# EAGLE schematic Parallel CS V5 repeated (EAGLE 7.2.0)

## Sheet 1 of 2: Input Layer
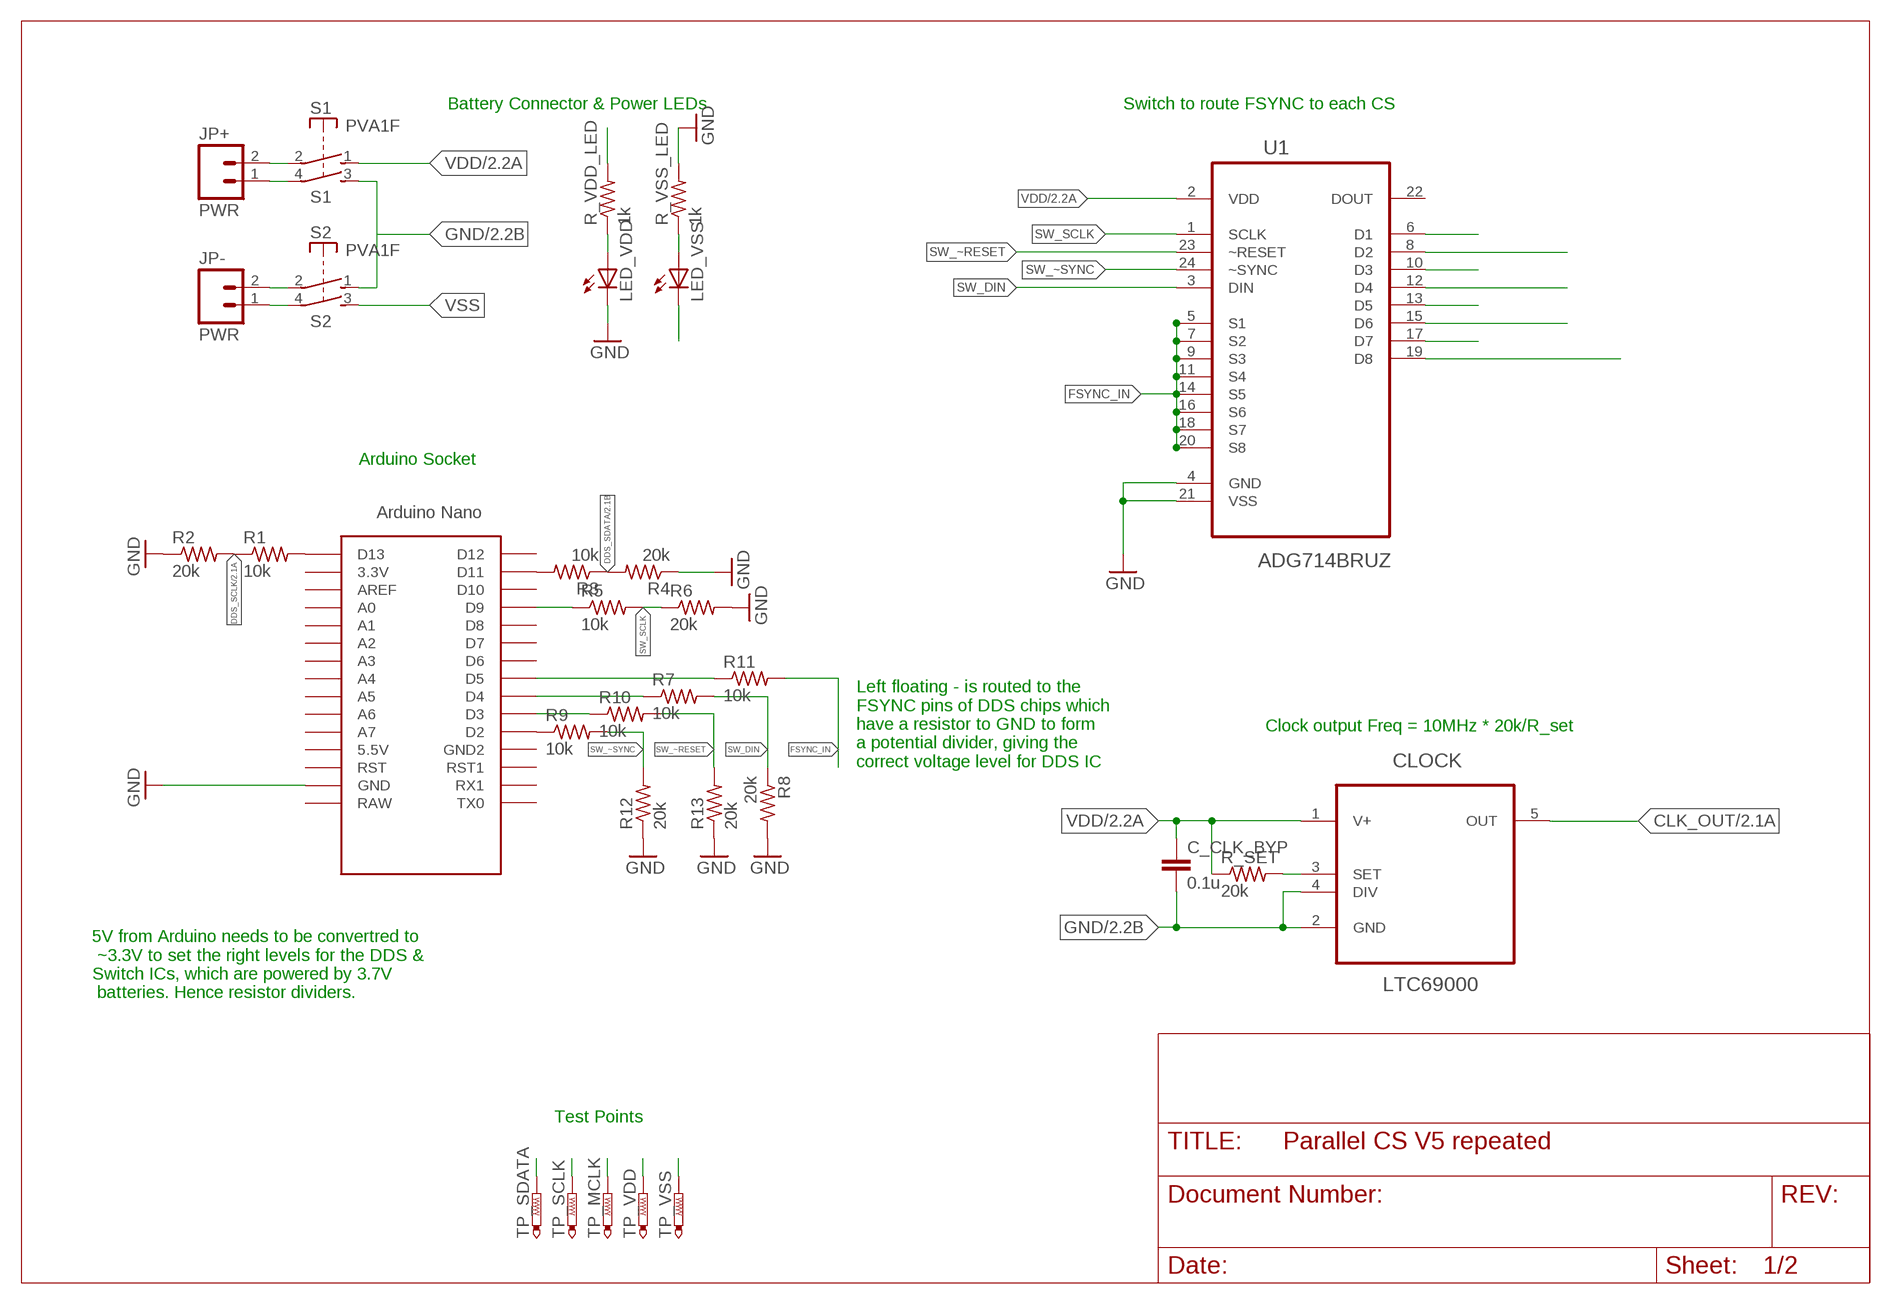
[diagram p0: schematic, sheet 1]

### Parts
C_CLK_BYP  0.1u  C-EUC0805  [C0805]
CLOCK  LTC69000  [SOT23-5L]
JP+  PWR  M02-JST-2MM-SMT  [JST-2-SMD]
JP-  PWR  M02-JST-2MM-SMT  [JST-2-SMD]
LED_VDD  LEDSML0805  [SML0805]
LED_VSS  LEDSML0805  [SML0805]
R1  10k  R-US_R0805  [R0805]
R2  20k  R-US_R0805  [R0805]
R3  10k  R-US_R0805  [R0805]
R4  20k  R-US_R0805  [R0805]
R5  10k  R-US_R0805  [R0805]
R6  20k  R-US_R0805  [R0805]
R7  10k  R-US_R0805  [R0805]
R8  20k  R-US_R0805  [R0805]
R9  10k  R-US_R0805  [R0805]
R10  10k  R-US_R0805  [R0805]
R11  10k  R-US_R0805  [R0805]
R12  20k  R-US_R0805  [R0805]
R13  20k  R-US_R0805  [R0805]
R_SET  20k  R-US_R0805  [R0805]
R_VDD_LED  1k  R-US_M0805  [M0805]
R_VSS_LED  1k  R-US_M0805  [M0805]
S1  PVA1F  [PVA1F]
S2  PVA1F  [PVA1F]
TP_MCLK  PTR1PAD1-13  [P1-13]
TP_SCLK  PTR1PAD1-13  [P1-13]
TP_SDATA  PTR1PAD1-13  [P1-13]
TP_VDD  PTR1PAD1-13  [P1-13]
TP_VSS  PTR1PAD1-13  [P1-13]
U1  ADG714BRUZ  [SOP65P640X120-24N]
U$1  NANO  [NANO]

### Nets
CLK_OUT: CLOCK.5(OUT) TP_MCLK.TP ; also sheet 2
DDS_SCLK: R1.1 R2.2 TP_SCLK.TP ; also sheet 2
DDS_SCLK_5V: R1.2 U$1.D13
DDS_SDATA: R3.1 R4.2 TP_SDATA.TP ; also sheet 2
FSYNC_CS1: U1.6(D1)
FSYNC_CS2: U1.8(D2)
FSYNC_CS3: U1.10(D3)
FSYNC_CS4: U1.12(D4)
FSYNC_CS5: U1.13(D5)
FSYNC_CS6: U1.15(D6)
FSYNC_CS7: U1.17(D7)
FSYNC_CS8: U1.19(D8)
FSYNC_IN: R11.2 U1.5(S1) U1.7(S2) U1.9(S3) U1.11(S4) U1.14(S5) U1.16(S6) U1.18(S7) U1.20(S8)
FSYNC_IN_5V: R11.1 U$1.D5
GND: C_CLK_BYP.2 CLOCK.2(GND) CLOCK.4(DIV) LED_VDD.C R2.1 R4.1 R6.2 R8.2 R12.1 R13.1 R_VSS_LED.2 S1.3(2:S) S2.1(1:S) U1.4(GND) U1.21(VSS) U$1.GND ; also sheet 2
N$2: CLOCK.3(SET) R_SET.2
N$15: JP+.2 S1.2(1:P)
N$16: JP+.1 S1.4(2:P)
N$18: JP-.2 S2.2(1:P)
N$19: JP-.1 S2.4(2:P)
N$21: LED_VDD.A R_VDD_LED.1
N$22: LED_VSS.A R_VSS_LED.1
N$23: R3.2 U$1.D11
SW_DIN: R7.2 R8.1 U1.3(DIN)
SW_DIN_5V: R7.1 U$1.D4
SW_SCLK: R5.2 R6.1 U1.1(SCLK)
SW_SCLK_5V: R5.1 U$1.D9
SW_~RESET: R10.2 R13.2 U1.23(~RESET)
SW_~RESET_5V: R10.1 U$1.D3
SW_~SYNC: R9.2 R12.2 U1.24(~SYNC)
SW_~SYNC_5V: R9.1 U$1.D2
VDD: C_CLK_BYP.1 CLOCK.1(V+) R_SET.1 R_VDD_LED.2 S1.1(1:S) TP_VDD.TP U1.2(VDD) ; also sheet 2
VSS: LED_VSS.C S2.3(2:S) TP_VSS.TP ; also sheet 2
Unconnected: U1.22(DOUT) U$1.3.3V U$1.5V(5.5V) U$1.A0 U$1.A1 U$1.A2 U$1.A3 U$1.A4 U$1.A5 U$1.A6 U$1.A7 U$1.AREF U$1.D6 U$1.D7 U$1.D8 U$1.D10 U$1.D12 U$1.GND1(GND2) U$1.ICSP1 U$1.ICSP2 U$1.ICSP3 U$1.ICSP4 U$1.ICSP5 U$1.ICSP6 U$1.RAW U$1.RST U$1.RST1 U$1.RX1 U$1.TX0

### Notes on the sheet
- Battery Connector & Power LEDs | Switch to route FSYNC to each CS
- Arduino Socket
- Clock output Freq = 10MHz * 20k/R_set
- Left floating - is routed to the
  FSYNC pins of DDS chips which
  have a resistor to GND to form
  a potential divider, giving the 
  correct voltage level for DDS IC
- 5V from Arduino needs to be convertred to
   ~3.3V to set the right levels for the DDS & 
  Switch ICs, which are powered by 3.7V
   batteries. Hence resistor dividers.
- Test Points

## Sheet 2 of 2: Current Source Block
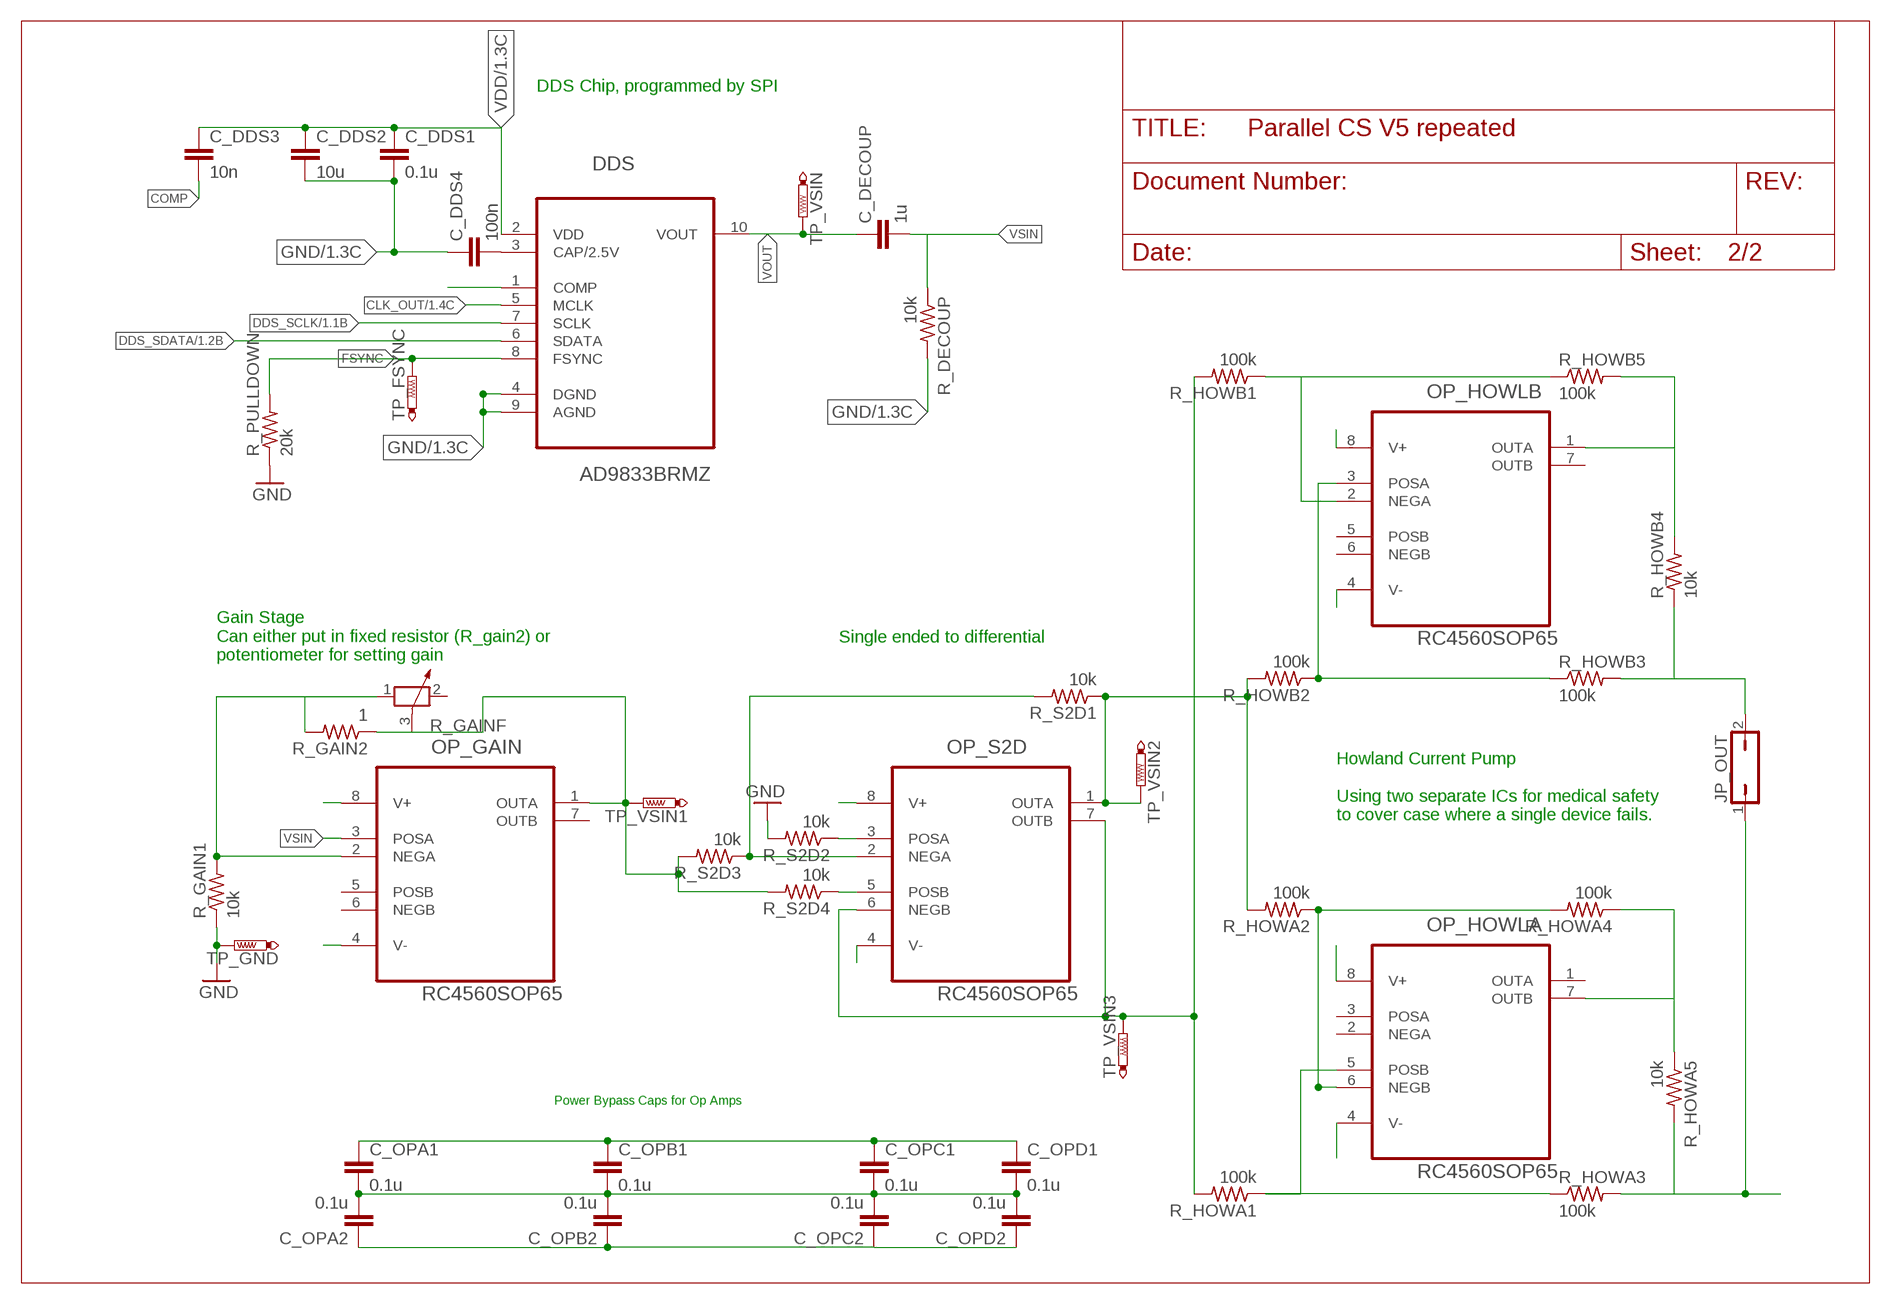
[diagram p1: schematic, sheet 2]

### Parts
C_DDS1  0.1u  C-EUC0805  [C0805]
C_DDS2  10u  C-EUC0805  [C0805]
C_DDS3  10n  C-EUC0805  [C0805]
C_DDS4  100n  C-EUC0805  [C0805]
C_DECOUP  1u  C-EUC0805  [C0805]
C_OPA1  0.1u  C-EUC0805  [C0805]
C_OPA2  0.1u  C-EUC0805  [C0805]
C_OPB1  0.1u  C-EUC0805  [C0805]
C_OPB2  0.1u  C-EUC0805  [C0805]
C_OPC1  0.1u  C-EUC0805  [C0805]
C_OPC2  0.1u  C-EUC0805  [C0805]
C_OPD1  0.1u  C-EUC0805  [C0805]
C_OPD2  0.1u  C-EUC0805  [C0805]
DDS  AD9833BRMZ  [SOP50P490X110-10N]
JP_OUT  JP1Q  [JP1]
OP_GAIN  RC4560SOP65  [SOP65P490X109-8N]
OP_HOWLA  RC4560SOP65  [SOP65P490X109-8N]
OP_HOWLB  RC4560SOP65  [SOP65P490X109-8N]
OP_S2D  RC4560SOP65  [SOP65P490X109-8N]
R_DECOUP  10k  R-US_R0805  [R0805]
R_GAIN1  10k  R-US_R0805  [R0805]
R_GAIN2  1  R-US_R0805  [R0805]
R_GAINF  POTENTIOMETER_PT-10  [PT-10]
R_HOWA1  100k  R-US_R0805  [R0805]
R_HOWA2  100k  R-US_R0805  [R0805]
R_HOWA3  100k  R-US_R0805  [R0805]
R_HOWA4  100k  R-US_R0805  [R0805]
R_HOWA5  10k  R-US_R0805  [R0805]
R_HOWB1  100k  R-US_R0805  [R0805]
R_HOWB2  100k  R-US_R0805  [R0805]
R_HOWB3  100k  R-US_R0805  [R0805]
R_HOWB4  10k  R-US_R0805  [R0805]
R_HOWB5  100k  R-US_R0805  [R0805]
R_PULLDOWN  20k  R-US_R0805  [R0805]
R_S2D1  10k  R-US_R0805  [R0805]
R_S2D2  10k  R-US_R0805  [R0805]
R_S2D3  10k  R-US_R0805  [R0805]
R_S2D4  10k  R-US_R0805  [R0805]
TP_FSYNC  PTR1PAD1-13  [P1-13]
TP_GND  PTR1PAD1-13  [P1-13]
TP_VSIN  PTR1PAD1-13  [P1-13]
TP_VSIN1  PTR1PAD1-13  [P1-13]
TP_VSIN2  PTR1PAD1-13  [P1-13]
TP_VSIN3  PTR1PAD1-13  [P1-13]

### Nets
CLK_OUT: DDS.5(MCLK) ; also sheet 1
COMP: C_DDS3.2 DDS.1(COMP)
DDS_SCLK: DDS.7(SCLK) ; also sheet 1
DDS_SDATA: DDS.6(SDATA) ; also sheet 1
FSYNC: DDS.8(FSYNC) R_PULLDOWN.2 TP_FSYNC.TP
GND: C_DDS1.2 C_DDS2.2 C_DDS4.1 C_OPA1.2 C_OPA2.2 C_OPB1.2 C_OPB2.2 C_OPC1.2 C_OPC2.2 C_OPD1.2 C_OPD2.2 DDS.4(DGND) DDS.9(AGND) R_DECOUP.2 R_GAIN1.1 R_PULLDOWN.1 R_S2D2.2 TP_GND.TP ; also sheet 1
N$1: C_DDS4.2 DDS.3(CAP/2.5V)
N$3: OP_GAIN.1(OUTA) R_GAIN2.1 R_GAINF.3 R_S2D3.2 R_S2D4.2 TP_VSIN1.TP
N$4: OP_S2D.6(NEGB) OP_S2D.7(OUTB) R_HOWA1.2 R_HOWB1.2 TP_VSIN3.TP
N$5: OP_GAIN.2(NEGA) R_GAIN1.2 R_GAIN2.2 R_GAINF.1
N$6: OP_S2D.5(POSB) R_S2D4.1
N$7: OP_HOWLA.5(POSB) R_HOWA1.1 R_HOWA3.1
N$8: OP_S2D.1(OUTA) R_HOWA2.2 R_HOWB2.2 R_S2D1.1 TP_VSIN2.TP
N$9: OP_S2D.3(POSA) R_S2D2.1
N$10: OP_S2D.2(NEGA) R_S2D1.2 R_S2D3.1
N$11: OP_HOWLB.3(POSA) R_HOWB2.1 R_HOWB3.1
N$12: OP_HOWLB.2(NEGA) R_HOWB1.1 R_HOWB5.1
N$13: JP_OUT.2 R_HOWB3.2 R_HOWB4.1
N$14: JP_OUT.1 R_HOWA3.2 R_HOWA5.2
N$17: OP_HOWLA.7(OUTB) R_HOWA4.1 R_HOWA5.1
N$20: OP_HOWLA.6(NEGB) R_HOWA2.1 R_HOWA4.2
N$24: OP_HOWLB.1(OUTA) R_HOWB4.2 R_HOWB5.2
VDD: C_DDS1.1 C_DDS2.1 C_DDS3.1 C_OPA1.1 C_OPB1.1 C_OPC1.1 C_OPD1.1 DDS.2(VDD) OP_GAIN.8(V+) OP_HOWLA.8(V+) OP_HOWLB.8(V+) OP_S2D.8(V+) ; also sheet 1
VOUT: C_DECOUP.1 DDS.10(VOUT) TP_VSIN.TP
VSIN: C_DECOUP.2 OP_GAIN.3(POSA) R_DECOUP.1
VSS: C_OPA2.1 C_OPB2.1 C_OPC2.1 C_OPD2.1 OP_GAIN.4(V-) OP_HOWLA.4(V-) OP_HOWLB.4(V-) OP_S2D.4(V-) ; also sheet 1
Unconnected: OP_GAIN.5(POSB) OP_GAIN.6(NEGB) OP_GAIN.7(OUTB) OP_HOWLA.1(OUTA) OP_HOWLA.2(NEGA) OP_HOWLA.3(POSA) OP_HOWLB.5(POSB) OP_HOWLB.6(NEGB) OP_HOWLB.7(OUTB) R_GAINF.2

### Notes on the sheet
- DDS Chip, programmed by SPI
- Single ended to differential
- Gain Stage
  Can either put in fixed resistor (R_gain2) or
  potentiometer for setting gain
- Howland Current Pump
  
  Using two separate ICs for medical safety
  to cover case where a single device fails.
- Power Bypass Caps for Op Amps

## Library data of the parts
C_CLK_BYP C_DDS1-C_DDS4 C_DECOUP C_OPA1 C_OPA2 C_OPB1 C_OPB2 C_OPC1 C_OPC2 C_OPD1 C_OPD2 = resistor:C-EU: CAPACITOR, European symbol
CLOCK = LTC6900:LTC69000: Low Power, 1kHz to 20MHz Resistor Set SOT-23 Oscillator
DDS = ad9833:AD9833BRMZ: Low Power 12.65 mW, 2.3 V to 5.5 V,Low Power 12.65 mW, 2.3 V to 5.5 V,Low Power 12.65 mW, 2.3 V to 5.5 V,Programmable Waveform Generator; MPN: AD9833BRMZ; OC_FARNELL: 1581966; OC_NEWARK: 19M1014; PACKAGE: MSOP-10; SUPPLIER: Analog Devices
JP+ JP- = SwitchBoard:M02: Header 2 Standard 2-pin 0.1" header. Use with straight break away headers (SKU : PRT-00116), right angle break away headers (PRT-00553), swiss pins (PRT-00743), machine pins (PRT-00117), and female headers (PRT-00115). Molex polarized connector foot print use with SKU : PRT-08233 with associated crimp pins and housings.
JP_OUT = jumper:JP1Q: JUMPER
LED_VDD LED_VSS = led:LED: LED OSRAM: - CHIPLED LG R971, LG N971, LY N971, LG Q971, LY Q971, LO R971, LY R971 LH N974, LH R974 LS Q976, LO Q976, LY Q976 LO Q996 - Hyper CHIPLED LW Q18S LB Q993, LB Q99A, LB R99A - SideLED LS A670, LO A670, LY A670, LG A670, LP A670 LB A673, LV A673, LT A673, LW A673 LH A674 LY A675 LS A676, LA A676, LO A676, LY A676, LW A676 LS A679, LY A679, LG A679 - Hyper Micro SIDELED® LS Y876, LA Y876, LO Y876, LY Y876 LT Y87S - SmartLED LW L88C, LW L88S LB L89C, LB L89S, LG L890 LS L89K, LO L89K, LY L89K LS L896, LA L896, LO L896, LY L896 - TOPLED LS T670, LO T670, LY T670, LG T670, LP T670 LSG T670, LSP T670, LSY T670, LOP T670, LYG T670 LG T671, LOG T671, LSG T671 LB T673, LV T673, LT T673, LW T673 LH T674 LS T676, LA T676, LO T676, LY T676, LB T676, LH T676, LSB T676, LW T676 LB T67C, LV T67C, LT T67C, LS T67K, LO T67K, LY T67K, LW E67C LS E67B, LA E67B, LO E67B, LY E67B, LB E67C, LV E67C, LT E67C LW T67C LS T679, LY T679, LG T679 LS T770, LO T770, LY T770, LG T770, LP T770 LB T773, LV T773, LT T773, LW T773 LH T774 LS E675, LA E675, LY E675, LS T675 LS T776, LA T776, LO T776, LY T776, LB T776 LHGB T686 LT T68C, LB T68C - Hyper Mini TOPLED® LB M676 - Mini TOPLED Santana® LG M470 LS M47K, LO M47K, LY M47K Source: http://www.osram.convergy.de LUXEON: - LUMILED® LXK2-PW12-R00, LXK2-PW12-S00, LXK2-PW14-U00, LXK2-PW14-V00 LXK2-PM12-R00, LXK2-PM12-S00, LXK2-PM14-U00 LXK2-PE12-Q00, LXK2-PE12-R00, LXK2-PE12-S00, LXK2-PE14-T00, LXK2-PE14-U00 LXK2-PB12-K00, LXK2-PB12-L00, LXK2-PB12-M00, LXK2-PB14-N00, LXK2-PB14-P00, LXK2-PB14-Q00 LXK2-PR12-L00, LXK2-PR12-M00, LXK2-PR14-Q00, LXK2-PR14-R00 LXK2-PD12-Q00, LXK2-PD12-R00, LXK2-PD12-S00 LXK2-PH12-R00, LXK2-PH12-S00 LXK2-PL12-P00, LXK2-PL12-Q00, LXK2-PL12-R00 Source: www.luxeon.com KINGBRIGHT: KA-3528ASYC Source: www.kingbright.com
OP_GAIN OP_HOWLA OP_HOWLB OP_S2D = RC4560:RC4560: RC4560 Op-Amp Texas Instruments
R1-R13 R_SET R_VDD_LED R_VSS_LED = resistor:R-US_: RESISTOR, American symbol
R_DECOUP R_GAIN1 R_GAIN2 R_HOWA1-R_HOWA5 R_HOWB1-R_HOWB5 R_PULLDOWN R_S2D1-R_S2D4 = rcl:R-US_: RESISTOR, American symbol
R_GAINF = rcl:POTENTIOMETER_: Potentiometer
S1 S2 = switch-misc:PVA1: ITT SWITCH
TP_FSYNC TP_GND TP_MCLK TP_SCLK TP_SDATA TP_VDD TP_VSIN TP_VSIN1-TP_VSIN3 TP_VSS = testpad:PTR1: TEST PIN
U1 = SwitchBoard:ADG714BRUZ: CMOS, Low Voltage Serially Controlled, Octal SPST Switches; MPN: ADG714BRUZ; OC_FARNELL: 9604367; OC_NEWARK: 59K1531; PACKAGE: TSSOP-24; SUPPLIER: Analog Devices
U$1 = Arduino-clone:NANO: Arduino Nano